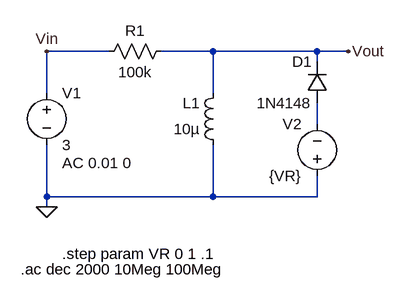
[diagram p0: schematic Lab2Part3.asc]
Lab2Part3.asc, the LTspice schematic file:
Version 4
SHEET 1 880 680
WIRE 192 80 96 80
WIRE 352 80 272 80
WIRE 512 80 352 80
WIRE 560 80 512 80
WIRE 512 96 512 80
WIRE 96 144 96 80
WIRE 352 144 352 80
WIRE 512 192 512 160
WIRE 96 304 96 224
WIRE 352 304 352 224
WIRE 352 304 96 304
WIRE 512 304 512 272
WIRE 512 304 352 304
WIRE 96 320 96 304
FLAG 96 80 Vin
FLAG 96 320 0
FLAG 560 80 Vout
SYMBOL voltage 96 128 R0
WINDOW 123 24 124 Left 2
WINDOW 39 0 0 Left 0
SYMATTR InstName V1
SYMATTR Value 3
SYMATTR Value2 AC 0.01 0
SYMBOL res 288 64 R90
WINDOW 0 0 56 VBottom 2
WINDOW 3 32 56 VTop 2
SYMATTR InstName R1
SYMATTR Value 100k
SYMBOL ind 368 240 R180
WINDOW 0 36 80 Left 2
WINDOW 3 36 40 Left 2
SYMATTR InstName L1
SYMATTR Value 10µ
SYMBOL diode 528 160 R180
WINDOW 0 24 64 Left 2
WINDOW 3 24 0 Left 2
SYMATTR InstName D1
SYMATTR Value 1N4148
SYMBOL voltage 512 288 R180
WINDOW 0 24 96 Left 2
WINDOW 3 24 16 Left 2
WINDOW 123 0 0 Left 0
WINDOW 39 0 0 Left 0
SYMATTR InstName V2
SYMATTR Value {VR}
TEXT 120 392 Left 2 !.step param VR 0 1 .1
TEXT 56 416 Left 2 !.ac dec 2000 10Meg 100Meg

The netlist it stands for:
* Lab2Part3.asc
V1 Vin 0 3 AC 0.01 0
R1 Vout Vin 100k
L1 0 Vout 10µ
D1 N001 Vout 1N4148
V2 0 N001 {VR}
.model D D
.lib standard.dio
.step param VR 0 1 .1
.ac dec 2000 10Meg 100Meg
.backanno
.end

* Results of the author's LTspice run, read from the files saved beside the schematic
* Operating Point (first step), zero values left out:
*   V(vin) = 3 V
*   V(vout) = 30 nV
*   I(L1) = -30 µA
*   I(R1) = -30 µA
*   I(V1) = -30 µA
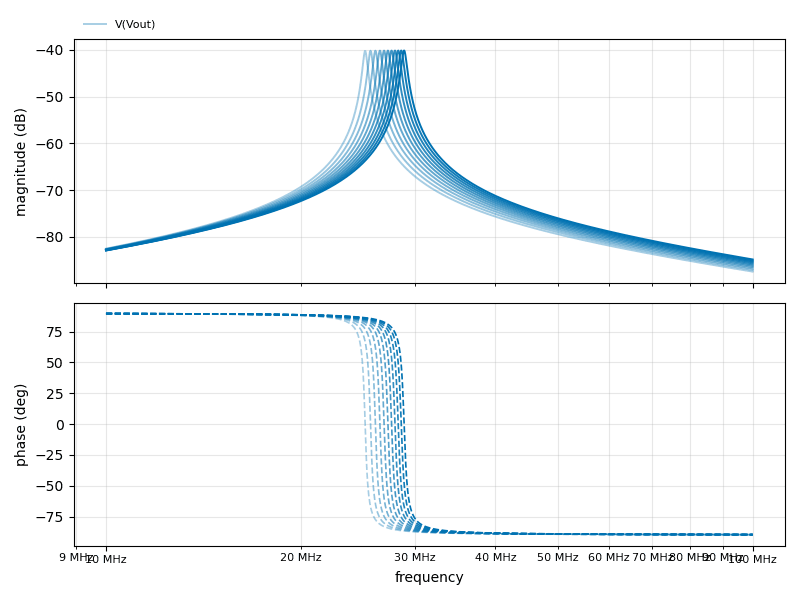
[diagram p1: AC Analysis of Lab2Part3.asc, plotted from the saved traces]
* AC Analysis, 11 runs:
*   V(Vout) [vr=0]: -82.54 dB at 10 MHz, -87.44 dB at 100 MHz, peak -40.26 dB at 25.15 MHz, 3 dB below the peak at 24.96 MHz and 25.37 MHz
*   V(Vout) [vr=0.1]: -82.60 dB at 10 MHz, -87.08 dB at 100 MHz, peak -40.19 dB at 25.64 MHz, 3 dB below the peak at 25.44 MHz and 25.86 MHz
*   V(Vout) [vr=0.2]: -82.66 dB at 10 MHz, -86.76 dB at 100 MHz, peak -40.19 dB at 26.09 MHz, 3 dB below the peak at 25.88 MHz and 26.32 MHz
*   V(Vout) [vr=0.3]: -82.70 dB at 10 MHz, -86.46 dB at 100 MHz, peak -40.18 dB at 26.52 MHz, 3 dB below the peak at 26.3 MHz and 26.75 MHz
*   V(Vout) [vr=0.4]: -82.75 dB at 10 MHz, -86.18 dB at 100 MHz, peak -40.17 dB at 26.92 MHz, 3 dB below the peak at 26.69 MHz and 27.15 MHz
*   V(Vout) [vr=0.5]: -82.78 dB at 10 MHz, -85.92 dB at 100 MHz, peak -40.17 dB at 27.29 MHz, 3 dB below the peak at 27.05 MHz and 27.53 MHz
*   V(Vout) [vr=0.6]: -82.82 dB at 10 MHz, -85.68 dB at 100 MHz, peak -40.17 dB at 27.64 MHz, 3 dB below the peak at 27.4 MHz and 27.89 MHz
*   V(Vout) [vr=0.7]: -82.85 dB at 10 MHz, -85.45 dB at 100 MHz, peak -40.16 dB at 27.99 MHz, 3 dB below the peak at 27.73 MHz and 28.23 MHz